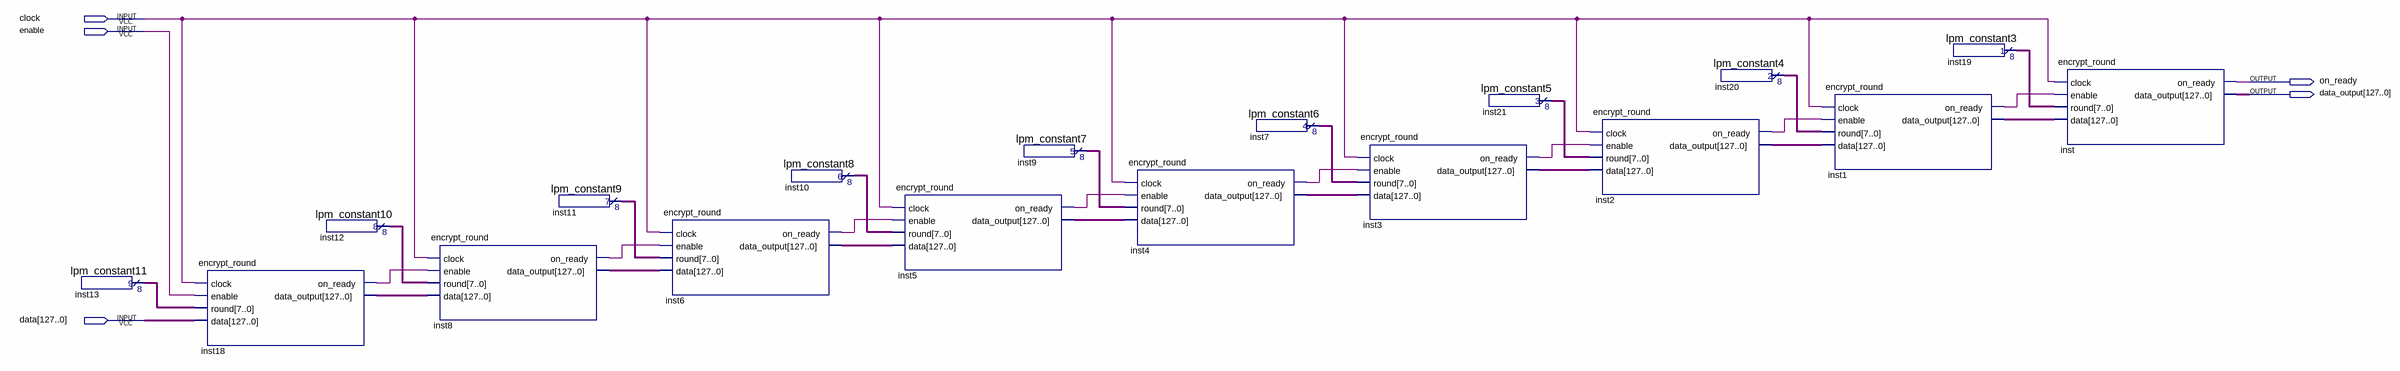
[diagram p0: schematic sheet]
// Quartus schematic 9rounds_decrypt.bdf as structural Verilog: 18 symbols, 5 pins
module \9rounds_decrypt  (
  input  clock,
  input  enable,
  input  [127:0] data,
  output on_ready,
  output [127:0] data_output
);

  wire inst1_on_ready, inst2_on_ready, inst3_on_ready, inst4_on_ready, inst5_on_ready, inst6_on_ready,
       inst8_on_ready, inst18_on_ready;
  wire [7:0] inst7_result, inst9_result, inst10_result, inst11_result, inst12_result, inst13_result,
       inst19_result, inst20_result, inst21_result;
  wire [127:0] inst1_data_output, inst2_data_output, inst3_data_output, inst4_data_output, inst5_data_output,
       inst6_data_output, inst8_data_output, inst18_data_output;

  lpm_constant11 inst13 (.result(inst13_result));
  encrypt_round inst18 (
    .clock(clock), .enable(enable), .round(inst13_result), .data(data), .on_ready(inst18_on_ready),
    .data_output(inst18_data_output));
  lpm_constant10 inst12 (.result(inst12_result));
  encrypt_round inst8 (
    .clock(clock), .enable(inst18_on_ready), .round(inst12_result), .data(inst18_data_output),
    .on_ready(inst8_on_ready), .data_output(inst8_data_output));
  lpm_constant9 inst11 (.result(inst11_result));
  encrypt_round inst6 (
    .clock(clock), .enable(inst8_on_ready), .round(inst11_result), .data(inst8_data_output),
    .on_ready(inst6_on_ready), .data_output(inst6_data_output));
  lpm_constant8 inst10 (.result(inst10_result));
  encrypt_round inst5 (
    .clock(clock), .enable(inst6_on_ready), .round(inst10_result), .data(inst6_data_output),
    .on_ready(inst5_on_ready), .data_output(inst5_data_output));
  lpm_constant7 inst9 (.result(inst9_result));
  encrypt_round inst4 (
    .clock(clock), .enable(inst5_on_ready), .round(inst9_result), .data(inst5_data_output),
    .on_ready(inst4_on_ready), .data_output(inst4_data_output));
  lpm_constant6 inst7 (.result(inst7_result));
  encrypt_round inst3 (
    .clock(clock), .enable(inst4_on_ready), .round(inst7_result), .data(inst4_data_output),
    .on_ready(inst3_on_ready), .data_output(inst3_data_output));
  lpm_constant5 inst21 (.result(inst21_result));
  encrypt_round inst2 (
    .clock(clock), .enable(inst3_on_ready), .round(inst21_result), .data(inst3_data_output),
    .on_ready(inst2_on_ready), .data_output(inst2_data_output));
  lpm_constant4 inst20 (.result(inst20_result));
  encrypt_round inst1 (
    .clock(clock), .enable(inst2_on_ready), .round(inst20_result), .data(inst2_data_output),
    .on_ready(inst1_on_ready), .data_output(inst1_data_output));
  lpm_constant3 inst19 (.result(inst19_result));
  encrypt_round inst (
    .clock(clock), .enable(inst1_on_ready), .round(inst19_result), .data(inst1_data_output),
    .on_ready(on_ready), .data_output(data_output));
endmodule
